# Altium schematic sheet 04_ANALOG_B.SchDoc
size A4
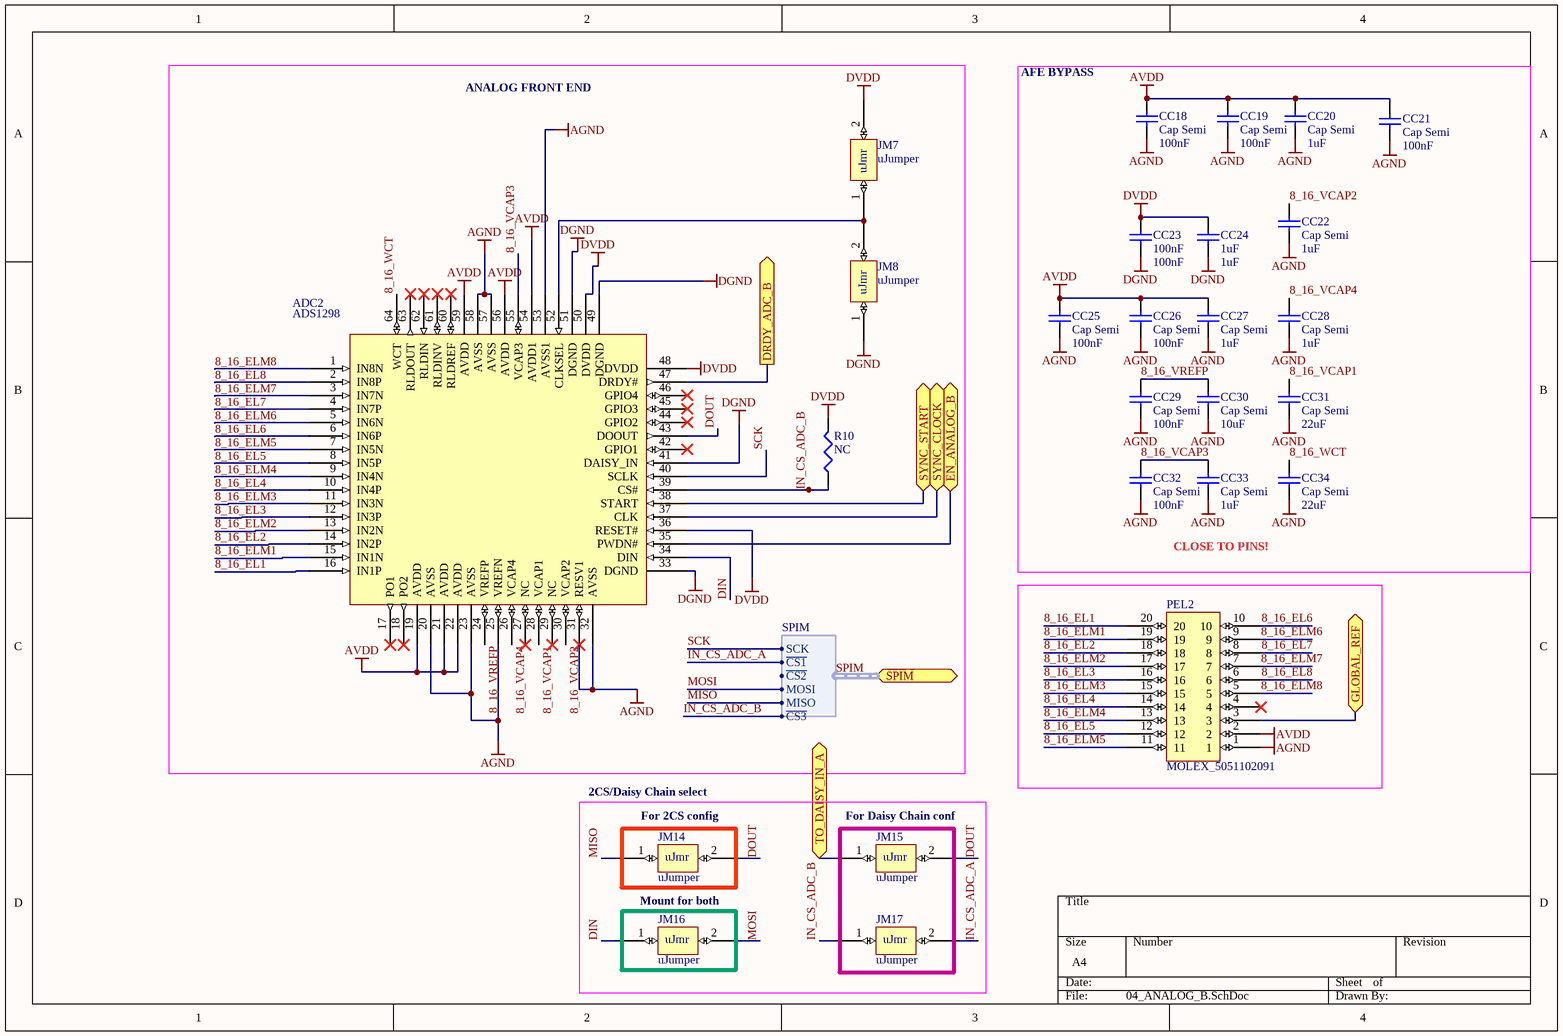
[diagram p0: 04_ANALOG_B.SchDoc]

## Parts
ADC2  ADS1298  [S-PQFP - G64 - ADS1298]
CC18  Cap Semi  value 100nF  [0402]
CC19  Cap Semi  value 100nF  [0402]
CC20  Cap Semi  value 1uF  [0402]
CC21  Cap Semi  value 100nF  [0402]
CC22  Cap Semi  value 1uF  [0402]
CC23  100nF  [0402]
CC24  1uF  [0402]
CC25  Cap Semi  value 100nF  [0402]
CC26  Cap Semi  value 100nF  [0402]
CC27  Cap Semi  value 1uF  [0402]
CC28  Cap Semi  value 1uF  [0402]
CC29  Cap Semi  value 100nF  [0402]
CC30  Cap Semi  value 10uF  [0402]
CC31  Cap Semi  value 22uF  [J1-0603]
CC32  Cap Semi  value 100nF  [0402]
CC33  Cap Semi  value 1uF  [0402]
CC34  Cap Semi  value 22uF  [1608[0603]]
JM7  uJumper  [UJMPR]
JM8  uJumper  [UJMPR]
JM14  uJumper  [UJMPR]
JM15  uJumper  [UJMPR]
JM16  uJumper  [UJMPR]
JM17  uJumper  [UJMPR]
PEL2  MOLEX_5051102091  [MOLEX_5051102091]
R10  NC  [0402]

## Blocks framed on the sheet
ANALOG FRONT END: ADC2 JM7 JM8 R10
For 2CS config: JM14
For Daisy Chain conf: JM15 JM17
Mount for both: JM16

## Ports
DRDY_ADC_B (out), EN_ANALOG_B (bidir), GLOBAL_REF (bidir), SPIM (harness SPIM), SYNC_CLOCK (bidir), SYNC_START (bidir), TO_DAISY_IN_A (bidir)

## Harnesses
SPIM: SCK, ~{CS1}, ~{CS2}, MOSI, MISO, ~{CS3}

## Nets
AGND: ADC2.20(AVSS) ADC2.23(AVSS) ADC2.25(VREFN) ADC2.31(RESV1) ADC2.32(AVSS) ADC2.53(AVSS1) ADC2.57(AVSS) ADC2.58(AVSS) CC18.1 CC19.1 CC20.1 CC21.1 CC22.1 CC25.1 CC26.1 CC27.1 CC28.1 CC29.1 CC30.1 CC31.1 CC32.1 CC33.1 CC34.1 PEL2.1
AVDD: ADC2.19(AVDD) ADC2.21(AVDD) ADC2.22(AVDD) ADC2.54(AVDD1) ADC2.56(AVDD) ADC2.59(AVDD) CC18.2 CC19.2 CC20.2 CC21.2 CC25.2 CC26.2 CC27.2 PEL2.2
DGND: ADC2.33(DGND) ADC2.41(DAISY_IN) ADC2.49(DGND) ADC2.51(DGND) CC23.1 CC24.1 JM8.1
DVDD: ADC2.36(RESET#) ADC2.48(DVDD) ADC2.50(DVDD) CC23.2 CC24.2 JM7.2 R10.2
8_16_EL1: ADC2.16(IN1P) PEL2.20
8_16_EL2: ADC2.14(IN2P) PEL2.18
8_16_EL3: ADC2.12(IN3P) PEL2.16
8_16_EL4: ADC2.10(IN4P) PEL2.14
8_16_EL5: ADC2.8(IN5P) PEL2.12
8_16_EL6: ADC2.6(IN6P) PEL2.10
8_16_EL7: ADC2.4(IN7P) PEL2.8
8_16_EL8: ADC2.2(IN8P) PEL2.6
8_16_ELM1: ADC2.15(IN1N) PEL2.19
8_16_ELM2: ADC2.13(IN2N) PEL2.17
8_16_ELM3: ADC2.11(IN3N) PEL2.15
8_16_ELM4: ADC2.9(IN4N) PEL2.13
8_16_ELM5: ADC2.7(IN5N) PEL2.11
8_16_ELM6: ADC2.5(IN6N) PEL2.9
8_16_ELM7: ADC2.3(IN7N) PEL2.7
8_16_ELM8: ADC2.1(IN8N) PEL2.5
8_16_VCAP1: ADC2.28(VCAP1) CC31.2
8_16_VCAP2: ADC2.30(VCAP2) CC22.2
8_16_VCAP3: ADC2.55(VCAP3) CC32.2 CC33.2
8_16_VCAP4: ADC2.26(VCAP4) CC28.2
8_16_VREFP: ADC2.24(VREFP) CC29.2 CC30.2
8_16_WCT: ADC2.64(WCT) CC34.2
DIN: ADC2.34(DIN) JM16.1
DOUT: ADC2.43(DOOUT) JM14.2 JM15.2
DRDY_ADC_B: ADC2.47(DRDY#) ; port DRDY_ADC_B
EN_ANALOG_B: ADC2.35(PWDN#) ; port EN_ANALOG_B
GLOBAL_REF: PEL2.3 ; port GLOBAL_REF
IN_CS_ADC_A: JM17.2 ; port SPIM.~{CS1}
IN_CS_ADC_B: ADC2.39(CS#) JM17.1 R10.1 ; port SPIM.~{CS3}
MISO: JM14.1 ; port SPIM.MISO
MOSI: JM16.2 ; port SPIM.MOSI
SCK: ADC2.40(SCLK) ; port SPIM.SCK
SYNC_CLOCK: ADC2.37(CLK) ; port SYNC_CLOCK
SYNC_START: ADC2.38(START) ; port SYNC_START
TO_DAISY_IN_A: JM15.1 ; port TO_DAISY_IN_A
NetADC2_52: ADC2.52(CLKSEL) JM7.1 JM8.2

Not connected (* = marked no-connect by the designer): ADC2 17(PO1)* 18(PO2)* 27(NC)* 29(NC)* 42(GPIO1)* 44(GPIO2)* 45(GPIO3)* 46(GPIO4)* 60(RLDREF)* 61(RLDINV)* 62(RLDIN)* 63(RLDOUT)*; PEL2 4*

## Buses and harness runs
harness SPIM = port SPIM

## Notes on the sheet
- AFE BYPASS
- CLOSE TO PINS!
- 2CS/Daisy Chain select
- (in symbol uJumper) uJmr

## Library data of the parts
CC18-CC34 = Cap Semi: Capacitor (Semiconductor SIM Model); Published: 8-Jun-2000; LatestRevisionDate: 29-May-2009; LatestRevisionNote: IPC-7351 Footprint Added.; PackageReference: C1206; Publisher: Altium Limited; PackageDescription: Chip Capacitor
  CC23: Value: 100nF
  CC24: Value: 1uF
R10 = Res3: Resistor; Published: 8-Jun-2000; LatestRevisionDate: 29-May-2009; LatestRevisionNote: IPC-7351 Footprint Added.; PackageReference: J1-0603; Publisher: Altium Limited; PackageDescription: Chip Resistor; Value: NC